# EAGLE design psu (EAGLE 6.4)
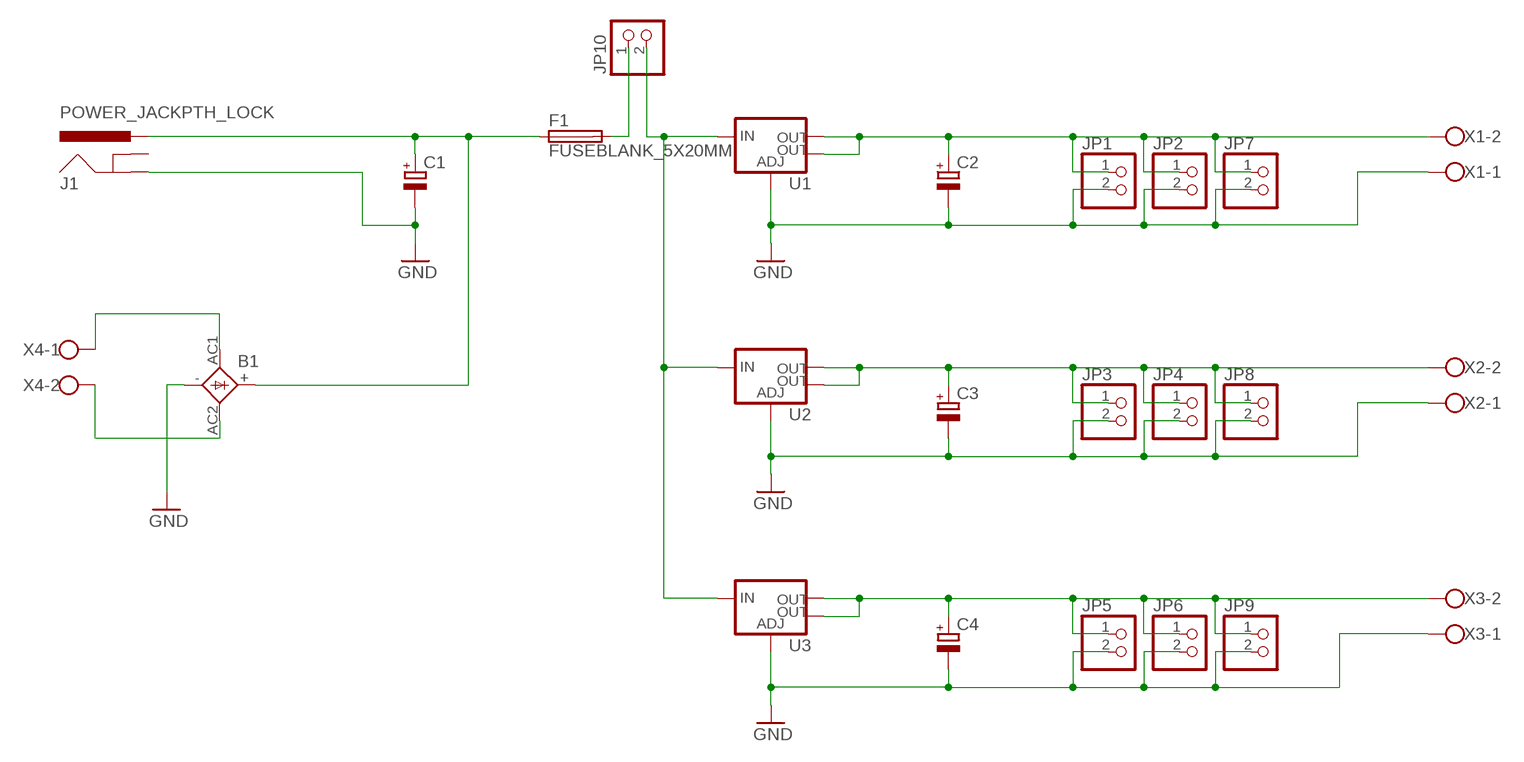
[diagram p0: schematic, sheet 1]

## Parts
B1  KBU  [KBU]
C1  CPOL-EUE5-10.5  [E5-10,5]
C2  CPOL-EUE2.5-7  [E2,5-7]
C3  CPOL-EUE2.5-7  [E2,5-7]
C4  CPOL-EUE2.5-7  [E2,5-7]
F1  FUSEBLANK_5X20MM  [FUSE_HOLDER_5X20MM]
J1  POWER_JACKPTH_LOCK  [POWER_JACK_PTH_LOCK]
JP1  PINHD-1X2  [1X02]
JP2  PINHD-1X2  [1X02]
JP3  PINHD-1X2  [1X02]
JP4  PINHD-1X2  [1X02]
JP5  PINHD-1X2  [1X02]
JP6  PINHD-1X2  [1X02]
JP7  PINHD-1X2  [1X02]
JP8  PINHD-1X2  [1X02]
JP9  PINHD-1X2  [1X02]
JP10  PINHD-1X2  [1X02]
U1  V_REG_LM1117SOT223  [SOT223]
U2  V_REG_LM1117SOT223  [SOT223]
U3  V_REG_LM1117SOT223  [SOT223]
X1  W237-102  [W237-102]
X2  W237-102  [W237-102]
X3  W237-102  [W237-102]
X4  W237-102  [W237-102]

## Nets
GND: B1.- C1.- C2.- C3.- C4.- J1.GND JP1.2 JP2.2 JP3.2 JP4.2 JP5.2 JP6.2 JP7.2 JP8.2 JP9.2 U1.1(ADJ) U2.1(ADJ) U3.1(ADJ) X1.1 X2.1 X3.1
N$1: B1.+ C1.+ F1.1 J1.PWR
N$2: C2.+ JP1.1 JP2.1 JP7.1 U1.2(OUT) U1.4(OUT) X1.2
N$3: C3.+ JP3.1 JP4.1 JP8.1 U2.2(OUT) U2.4(OUT) X2.2
N$4: C4.+ JP5.1 JP6.1 JP9.1 U3.2(OUT) U3.4(OUT) X3.2
N$5: B1.AC1 X4.1
N$6: B1.AC2 X4.2
N$7: JP10.2 U1.3(IN) U2.3(IN) U3.3(IN)
N$9: F1.2 JP10.1
Unconnected: J1.GNDBREAK

## Library data of the parts
B1 = rectifier:KBU: DIOTEC RECTIFIER
C1 = resistor:CPOL-EU: POLARIZED CAPACITOR, European symbol
C2-C4 = rcl:CPOL-EU: POLARIZED CAPACITOR, European symbol
F1 = fuse:FUSE: Fuse; OC_FARNELL: unknown; OC_NEWARK: unknown
J1 = SparkFun-Connectors:POWER_JACK: Power Jack This is the standard 5.5mm barrel jack for power. The PTH is the most common, proven, reliable, footprint. The Slot footprint only works if the mill layer is transmitted to the PCB fab house so be warned. Mating wall wart : TOL-00298 (and others); PROD_ID: CONN-08197; SF_ID: PRT-00119
JP1-JP10 = pinhead:PINHD-1X2: PIN HEADER
U1-U3 = SparkFun-PowerIC:V_REG_LM1117: Voltage Regulator LM1117 Standard adjustable voltage regulator but in SMD form. Spark Fun Electronics SKU : COM-00595; PROD_ID: VREG-08170
X1-X4 = con-wago-500:W237-102: WAGO SCREW CLAMP; MPN: 237-102; OC_FARNELL: unknown; OC_NEWARK: 70K9898

## Board
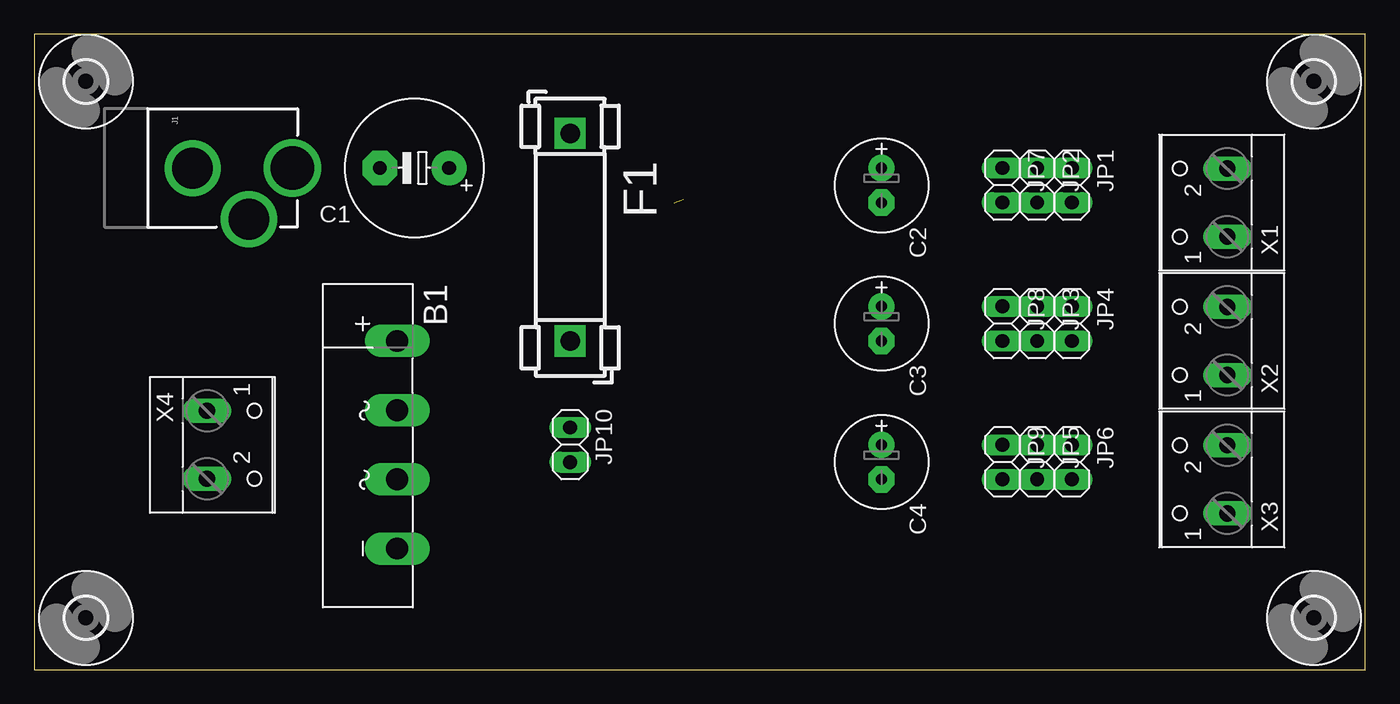
[diagram p1: board, top side]
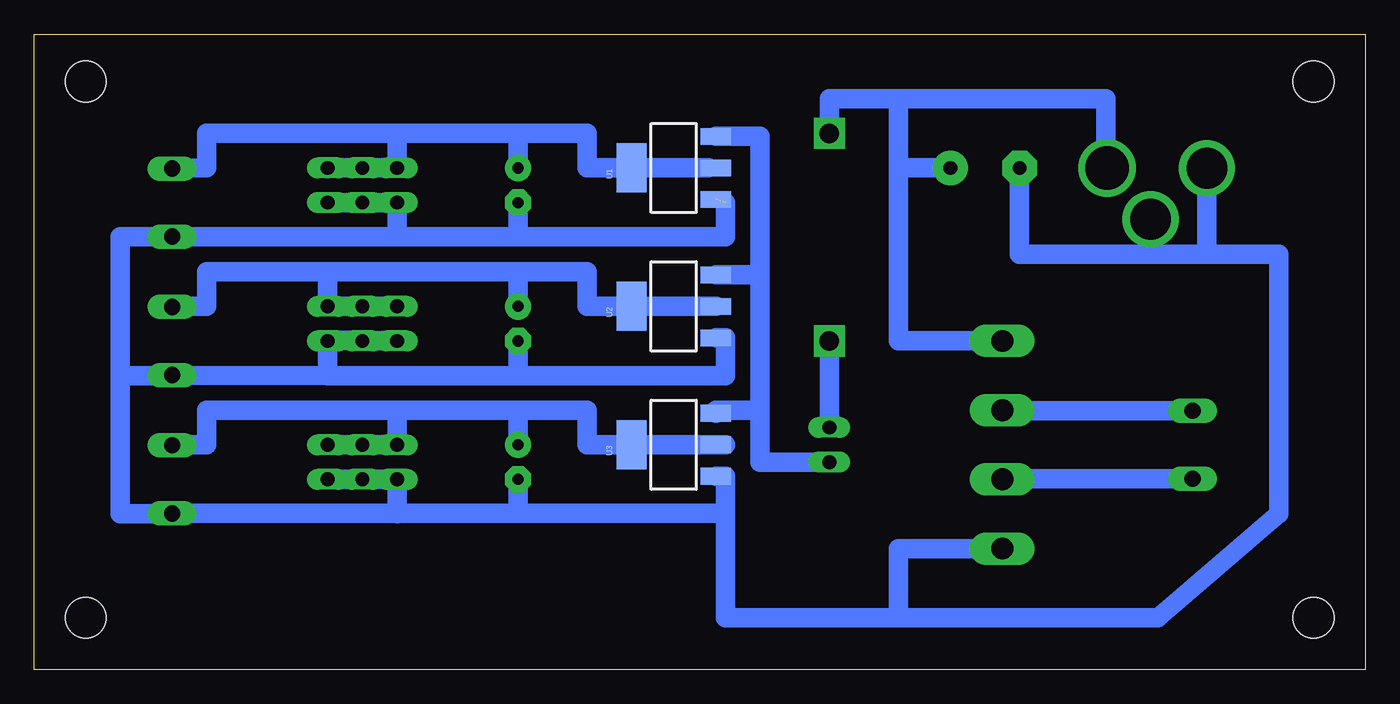
[diagram p2: board, bottom side, seen from below]

Size 97.77 x 46.66 mm. Coordinates in mm from the lower left corner, seen from the top.
Outline: 0,0 97.77,0 97.77,46.66 0,46.66 0,0
Copper layers (1*16): Top 0.035mm / dielectric 1.5mm / Bottom 0.035mm
Design rules "default": minimum track width 10mil, minimum drill 24mil, track to track 8mil, track to pad 8mil, pad to pad 8mil, via to via 8mil, smd to smd 8mil, copper to edge 40mil, drill to drill 8mil, minimum pad ring 10mil, minimum via ring 8mil, stop-mask expansion 4mil, vias tented up to drill 0mil, thermal gap 10mil

### Footprints (pad centres in the part's own frame; a part is rotated, then mirrored left to right if it is on the bottom)
KBU = drill 1.6 long: + -7.62,2.54; - 7.62,2.54; AC1 -2.54,2.54; AC2 2.54,2.54
E5-10,5 = drill 1.016 pad 2.54: + -2.54,0 | drill 1.016 pad 2.54 octagon: - 2.54,0
E2,5-7 = drill 0.813 pad 1.93: + -1.27,0 | drill 0.813 pad 1.93 octagon: - 1.27,0
FUSE_HOLDER_5X20MM = drill 1.422 pad 2.286 square: 1 0,0; 2 15.24,0
POWER_JACK_PTH_LOCK = drill 2.997 pad 4.115: GND 0.025,6.557; GNDBREAK 3.762,10.7 | drill 3.2 pad 4.115: PWR 0,13.878
1X02 = drill 1.016 long: 1 -1.27,0; 2 1.27,0
SOT223 = smd 1.219 x 2.235: 1 -2.311,-3.099; 2 0,-3.099; 3 2.311,-3.099 | smd 3.6 x 2.2: 4 0,3.099
3,0 = hole 3: 0,0
W237-102 = drill 1.194 long: 1 -2.5,-1.27; 2 2.5,-1.27

### Placement (x,y rotation side)
B1  24.13,16.51 270 top
C1  27.94,36.83 180 top
C2  62.23,35.56 270 top
C3  62.23,25.4 270 top
C4  62.23,15.24 270 top
F1  39.37,39.37 270 top
J1  5.08,36.83 270 top
JP1  76.2,35.56 270 top
JP2  73.66,35.56 270 top
JP3  73.66,25.4 270 top
JP4  76.2,25.4 270 top
JP5  73.66,15.24 270 top
JP6  76.2,15.24 270 top
JP7  71.12,35.56 270 top
JP8  71.12,25.4 270 top
JP9  71.12,15.24 270 top
JP10  39.37,16.51 270 top
U1  50.8,36.83 90 bottom
U2  50.8,26.67 90 bottom
U3  50.8,16.51 90 bottom
U$1  [3,0]  3.81,43.18 0 top
U$2  [3,0]  3.81,3.81 0 top
U$3  [3,0]  93.98,43.18 0 top
U$4  [3,0]  93.98,3.81 0 top
X1  86.36,34.29 90 top
X2  86.36,24.13 90 top
X3  86.36,13.97 90 top
X4  13.97,16.51 270 top

### Tracks (layer width: path | path; a pad name or v marks a point on that pad's centre or on a via)
GND  (1 unrouted)
  Bottom 0.254: 48.26,13.97 U3.1
  Bottom 1.422: JP9.2 JP5.2 JP6.2 JP9.2 | JP1.2 JP2.2 JP7.2 71.12,31.79 | 76.2,21.59 X2.1 87.63,21.59 91.44,21.59 | JP8.2 JP3.2 73.66,24.17 76.2,24.17 JP4.2 76.2,21.59 | U2.1 46.99,24.36 46.99,21.59 62.23,21.59 | 62.23,21.59 76.2,21.59 | C3.- 62.23,21.59 | 71.12,31.79 X1.1 91.44,31.79 91.44,21.59 | 71.12,31.79 62.23,31.79 | C2.- 62.23,31.79 | 71.12,11.47 X3.1 87.63,11.43 91.44,11.43 91.44,21.59 | 71.12,11.47 62.23,11.47 | 62.23,11.47 46.99,11.47 | 46.99,11.47 46.99,3.81 34.29,3.81 | 34.29,3.81 15.24,3.81 6.35,11.43 6.35,30.48 11.64,30.48 | 11.64,30.48 J1.GND | C1.- 25.4,30.48 11.64,30.48 | B1.- 34.29,8.89 34.29,3.81 | U3.1 46.99,14.2 46.99,11.47 | C4.- 62.23,11.47 | 71.12,11.47 71.12,11.43 | JP9.2 71.12,11.47 | 62.23,31.79 46.99,31.79 46.99,34.29
N$1
  Bottom 1.422: J1.PWR 19.05,36.83 19.05,41.91 34.29,41.91 | 34.29,41.91 39.37,41.91 F1.1 | C1.+ 34.29,36.83 | 34.29,36.83 34.29,41.91 | B1.+ 34.29,24.13 34.29,36.83
N$2
  Bottom 0.254: 48.26,36.83 U1.2
  Bottom 1.422: 76.2,36.79 JP1.1 JP2.1 JP7.1 71.12,39.37 | 48.26,36.83 U1.4 57.15,36.83 57.15,39.37 62.23,39.37 | 62.23,39.37 71.12,39.37 | 71.12,39.37 85.09,39.37 85.09,36.83 X1.2 | C2.+ 62.23,39.37
N$3
  Bottom 0.254: 87.63,26.67 X2.2 | 54.61,26.67 U2.4
  Bottom 1.422: JP8.1 JP3.1 JP4.1 76.2,29.21 | U2.4 U2.2 | 87.63,26.67 85.09,26.67 85.09,29.21 76.2,29.21 | 76.2,29.21 62.23,29.21 | 62.23,29.21 57.15,29.21 57.15,26.67 54.61,26.67 | C3.+ 62.23,29.21
N$4
  Bottom 0.254: 87.63,16.51 X3.2
  Bottom 1.422: 46.99,16.51 U3.2 U3.4 57.15,16.51 57.15,19.05 62.23,19.05 | 87.63,16.51 85.09,16.51 85.09,19.05 71.12,19.05 | C4.+ 62.23,19.05 | JP9.1 JP5.1 JP6.1 JP9.1 | JP9.1 71.12,19.05 | 71.12,19.05 62.23,19.05
N$5
  Bottom 1.422: X4.1 25.4,19.01 B1.AC1
N$6
  Bottom 1.422: X4.2 25.4,14.01 B1.AC2
N$7
  Bottom 1.422: U3.3 47.7,19.05 44.45,19.05 | U2.3 44.45,28.98 | U1.3 44.45,39.14 44.45,28.98 | 44.45,19.05 44.45,28.98 | JP10.2 44.45,15.24 44.45,19.05
N$9
  Bottom 1.422: F1.2 JP10.1

### Text on the board
_tsilk: DC_IN | + | +3V3 | F1 | + | +5V | OUT_EN | + | +5V | AC_IN